# EAGLE design esc (EAGLE 9.4.2)
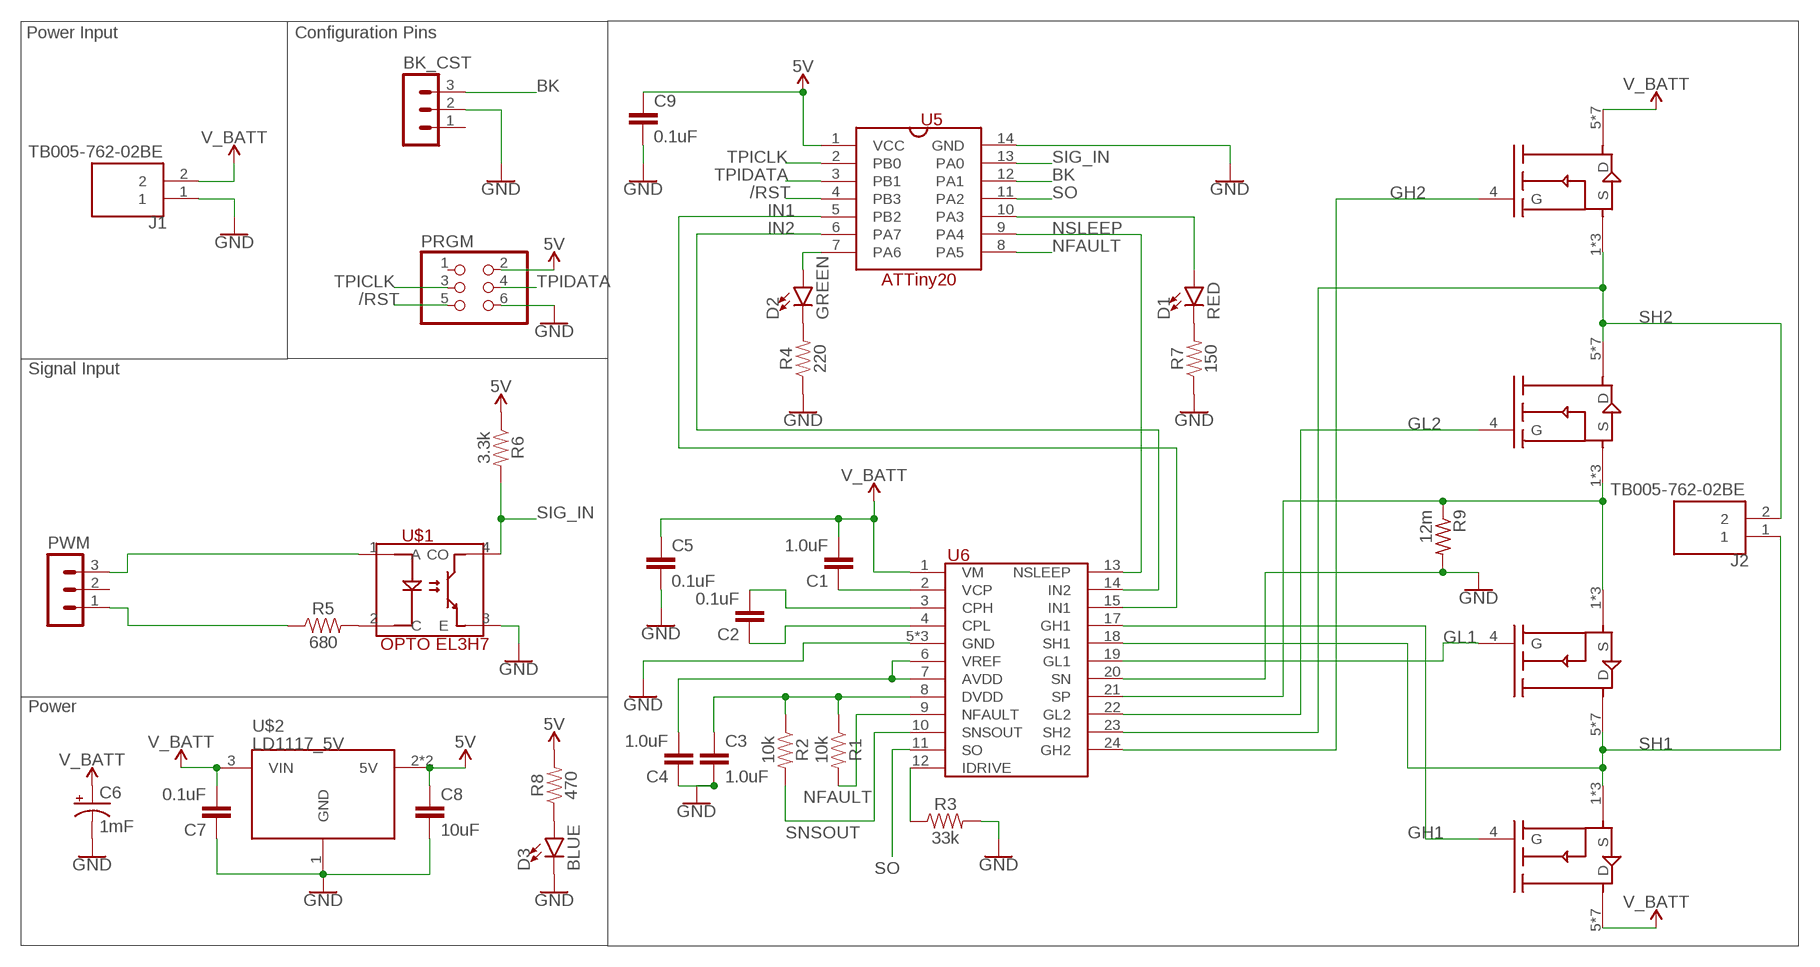
[diagram p0: schematic, sheet 1]

## Parts
BK_CST  MA03-1  [MA03-1]
C1  1.0uF  1.0UF-0603-16V-10%  [0603]
C2  0.1uF  0.1UF-0603-25V-5%  [0603]
C3  1.0uF  1.0UF-0603-16V-10%  [0603]
C4  1.0uF  1.0UF-0603-16V-10%  [0603]
C5  0.1uF  0.1UF-0603-25V-5%  [0603]
C6  1mF  1000UF-RADIAL-5MM-25V-20%  [CPOL-RADIAL-5MM-10MM]
C7  0.1uF  0.1UF-0603-25V-5%  [0603]
C8  10uF  10UF-0603-6.3V-20%  [0603]
C9  0.1uF  0.1UF-0603-25V-5%  [0603]
D1  RED  LED-RED0603  [LED-0603]
D2  GREEN  LED-GREEN0603  [LED-0603]
D3  BLUE  LED-BLUE0603  [LED-0603]
J1  TB005-762-02BE  [CUI_TB005-762-02BE]
J2  TB005-762-02BE  [CUI_TB005-762-02BE]
PRGM  PINHD-2X3  [2X03]
PWM  MA03-1  [MA03-1]
R1  10k  10KOHM-0603-1/10W-1%  [0603]
R2  10k  10KOHM-0603-1/10W-1%  [0603]
R3  33k  33KOHM-0603-1/10W-1%  [0603]
R4  220  220OHM-0603-1/10W-1%  [0603]
R5  680  680OHM-0603-1/10W-5%  [0603]
R6  3.3k  3.3KOHM-0603-1/10W-1%  [0603]
R7  150  150OHM-0603-1/10W-1%  [0603]
R8  470  470OHM-0603-1/10W-1%  [0603]
R9  12m  R-US_R2512  [R2512]
U1  AON6558  [POWER-SO8]
U2  AON6558  [POWER-SO8]
U3  AON6558  [POWER-SO8]
U4  AON6558  [POWER-SO8]
U5  ATTINY20  [SOIC127P599X265-14]
U6  DRV8701  [QFN50P400X400X100-25T280]
U$1  EL3H7  [SOIC127P700X265-4]
U$2  LD1117_5V  [SOT223]

## Nets
5V [5v]: C8.1 C9.1 PRGM.2 R6.1 R8.2 U5.1(VCC) U$2.2(5V) U$2.4(5V)
/RST: PRGM.5 U5.4(PB3)
BK: BK_CST.3 U5.12(PA1)
GH1: U4.4(G) U6.17(GH1)
GH2: U1.4(G) U6.24(GH2)
GL1: U3.4(G) U6.19(GL1)
GL2: U2.4(G) U6.22(GL2)
GND: BK_CST.2 C3.2 C4.1 C5.2 C6.- C7.1 C8.2 C9.2 D3.C J1.1 PRGM.6 R3.2 R4.1 R7.1 R9.2 U5.14(GND) U6.5(GND) U6.16(GND) U6.20(SN) U6.25(GND) U$1.3(E) U$2.1(GND)
IN: PWM.3 U$1.1(A)
IN1: U5.5(PB2) U6.15(IN1)
IN2: U5.6(PA7) U6.14(IN2)
IN_GND: PWM.1 R5.1
N$1: C1.1 U6.2(VCP)
N$2: C2.2 U6.3(CPH)
N$3: C2.1 U6.4(CPL)
N$4: D2.A U5.7(PA6)
N$5: C3.1 R1.1 R2.1 U6.8(DVDD)
N$6: R3.1 U6.12(IDRIVE)
N$7: C4.2 U6.6(VREF) U6.7(AVDD)
N$8: D1.A U5.10(PA3)
N$13: R5.2 U$1.2(C)
N$14: R9.1 U2.1(S) U2.2(S) U2.3(S) U3.1(S) U3.2(S) U3.3(S) U6.21(SP)
N$16: D2.C R4.2
N$17: D1.C R7.2
N$18: D3.A R8.1
NFAULT: R1.2 U5.8(PA5) U6.9(NFAULT)
NSLEEP: U5.9(PA4) U6.13(NSLEEP)
SH1 [power]: J2.1 U3.5(D) U3.6(D) U3.7(D) U3.8(D) U3.PAD(D) U3.SIDEPAD1(D) U3.SIDEPAD2(D) U4.1(S) U4.2(S) U4.3(S) U6.18(SH1)
SH2 [power]: J2.2 U1.1(S) U1.2(S) U1.3(S) U2.5(D) U2.6(D) U2.7(D) U2.8(D) U2.PAD(D) U2.SIDEPAD1(D) U2.SIDEPAD2(D) U6.23(SH2)
SIG_IN: R6.2 U5.13(PA0) U$1.4(CO)
SNSOUT: R2.2 U6.10(SNSOUT)
SO: U5.11(PA2) U6.11(SO)
TPICLK: PRGM.3 U5.2(PB0)
TPIDATA: PRGM.4 U5.3(PB1)
V_BATT [power]: C1.2 C5.1 C6.+ C7.2 J1.2 U1.5(D) U1.6(D) U1.7(D) U1.8(D) U1.PAD(D) U1.SIDEPAD1(D) U1.SIDEPAD2(D) U4.5(D) U4.6(D) U4.7(D) U4.8(D) U4.PAD(D) U4.SIDEPAD1(D) U4.SIDEPAD2(D) U6.1(VM) U$2.3(VIN)
Unconnected: BK_CST.1 PRGM.1 PWM.2

## Notes on the sheet
- Power Input | Configuration Pins
- Signal Input
- Power

## Library data of the parts
BK_CST PWM = con-lstb:MA03-1: PIN HEADER; OC_FARNELL: unknown; OC_NEWARK: unknown
C1 C3 C4 = SparkFun-Capacitors:1.0UF: 1µF ceramic capacitors A capacitor is a passive two-terminal electrical component used to store electrical energy temporarily in an electric field.; PROD_ID: CAP-00868
C2 C5 C7 C9 = SparkFun-Capacitors:0.1UF: 0.1µF ceramic capacitors A capacitor is a passive two-terminal electrical component used to store electrical energy temporarily in an electric field.; PROD_ID: CAP-08604
C6 = SparkFun-Capacitors:1000UF: 1,000µF/1mF ceramic capacitors A capacitor is a passive two-terminal electrical component used to store electrical energy temporarily in an electric field. CAP-08070; PROD_ID: CAP-09538
C8 = SparkFun-Capacitors:10UF: 10.0µF ceramic capacitors A capacitor is a passive two-terminal electrical component used to store electrical energy temporarily in an electric field.; PROD_ID: CAP-11015
D1 = SparkFun-LED:LED-RED: Red SMD LED Used in manufacturing of most products at SparkFun Packages: 0603 - SMD 0603 package [Product Link] <http://docs.avagotech.com/docs/AV02-0551EN> 0603 SMART - SMD 0603 SMART package ( more efficient and expensive)[Product Link] <http://www.osram-os.com/Graphics/XPic2/00077099_0.pdf> 1206 - SMD1206 package [Product Link] <https://www.sparkfun.com/datasheets/DevTools/LilyPad/Q150OVS4.pdff> SparkFun Products: Pro Mini 328 -5V <https://www.sparkfun.com/products/821> RedBoard <https://www.sparkfun.com/products/12757> IOIO-OTG <https://www.sparkfun.com/products/13613>; PROD_ID: DIO-00819
D2 = SparkFun-LED:LED-GREEN: Green SMD LED Used in manufacturing of various products at SparkFun Packages: 0603 - SMD 0603 package [Product Link] <http://www.futureelectronics.com/en/technologies/semiconductors/optoelectronics/leds/Pages/9894312-LTST-C190GKT.aspx?CrossPart=HSMG-C190&IM=0> LilyPad 1206 - SMD1206 LilyPad package [Product Link] <http://www.futureelectronics.com/en/Technologies/Product.aspx?ProductID=IN150NGHARVATEKCORPORATION2049943&IM=0> 1206 - SMD1206 package [Product Link] <http://www.futureelectronics.com/en/technologies/semiconductors/optoelectronics/leds/Pages/8315665-LTST-C150KGKT.aspx?IM=0> 1206 Bottom Mount -SMD 1206 Bottom Mount [Product Link] <http://www.digikey.com/product-detail/en/lite-on-inc/LTST-C230KGKT/160-1456-1-ND/386854> SparkFun Products: Pro Mini 328 -5V <https://www.sparkfun.com/products/821> RedBoard <https://www.sparkfun.com/products/12757> MP3 Trigger <https://www.sparkfun.com/products/13720> Makey Makey <https://www.sparkfun.com/products/11076>; PROD_ID: DIO-00821
D3 = SparkFun-LED:LED-BLUE: Blue SMD LED Used in manufacturing of various products at SparkFun Packages: 0603 - SMD 0603 package [Product Link] <http://www.digikey.com/product-detail/en/SMLE12BC7TT86/511-1589-2-ND/1641808> 1206 - SMD1206 package [Product Link] <http://www.digikey.com/product-detail/en/lite-on-inc/LTST-C150TBKT/160-1643-1-ND/573584> SparkFun Products: ESP8266 Thing-Dev Board <https://www.sparkfun.com/products/13711> RedBoard <https://www.sparkfun.com/products/12757>; PROD_ID: DIO-08575
J1 J2 = TB005-762-02BE:TB005-762-02BE; MANUFACTURER: CUI; STANDARD: Manufacturer Recommendations
PRGM = pinhead:PINHD-2X3: PIN HEADER
R1 R2 = SparkFun-Resistors:10KOHM: 10kΩ resistor A resistor is a passive two-terminal electrical component that implements electrical resistance as a circuit element. Resistors act to reduce current flow, and, at the same time, act to lower voltage levels within circuits. - Wikipedia; PROD_ID: RES-00824
R3 = SparkFun-Resistors:33KOHM: 33kΩ resistor A resistor is a passive two-terminal electrical component that implements electrical resistance as a circuit element. Resistors act to reduce current flow, and, at the same time, act to lower voltage levels within circuits. - Wikipedia; PROD_ID: RES-08416
R4 = SparkFun-Resistors:220OHM: 220Ω resistor A resistor is a passive two-terminal electrical component that implements electrical resistance as a circuit element. Resistors act to reduce current flow, and, at the same time, act to lower voltage levels within circuits. - Wikipedia; PROD_ID: RES-07861
R5 = SparkFun-Resistors:680OHM: 680Ω resistor A resistor is a passive two-terminal electrical component that implements electrical resistance as a circuit element. Resistors act to reduce current flow, and, at the same time, act to lower voltage levels within circuits. - Wikipedia; PROD_ID: RES-09333
R6 = SparkFun-Resistors:3.3KOHM: 3.3kΩ resistor A resistor is a passive two-terminal electrical component that implements electrical resistance as a circuit element. Resistors act to reduce current flow, and, at the same time, act to lower voltage levels within circuits. - Wikipedia; PROD_ID: RES-07851
R7 = SparkFun-Resistors:150OHM: 150Ω resistor A resistor is a passive two-terminal electrical component that implements electrical resistance as a circuit element. Resistors act to reduce current flow, and, at the same time, act to lower voltage levels within circuits. - Wikipedia; PROD_ID: RES-11028
R8 = SparkFun-Resistors:470OHM: 470Ω resistor A resistor is a passive two-terminal electrical component that implements electrical resistance as a circuit element. Resistors act to reduce current flow, and, at the same time, act to lower voltage levels within circuits. - Wikipedia; PROD_ID: RES-07869
R9 = rcl:R-US_: RESISTOR, American symbol; SPICEPREFIX: R
U1-U4 = mine:AON6558
U5 = mine:ATTINY20
U6 = mine:DRV8701
U$1 = mine:EL3H7
U$2 = mine:LD1117_5V

## Net classes
0 default: width 0.305 mm
2 5v: width 0.61 mm

## Board
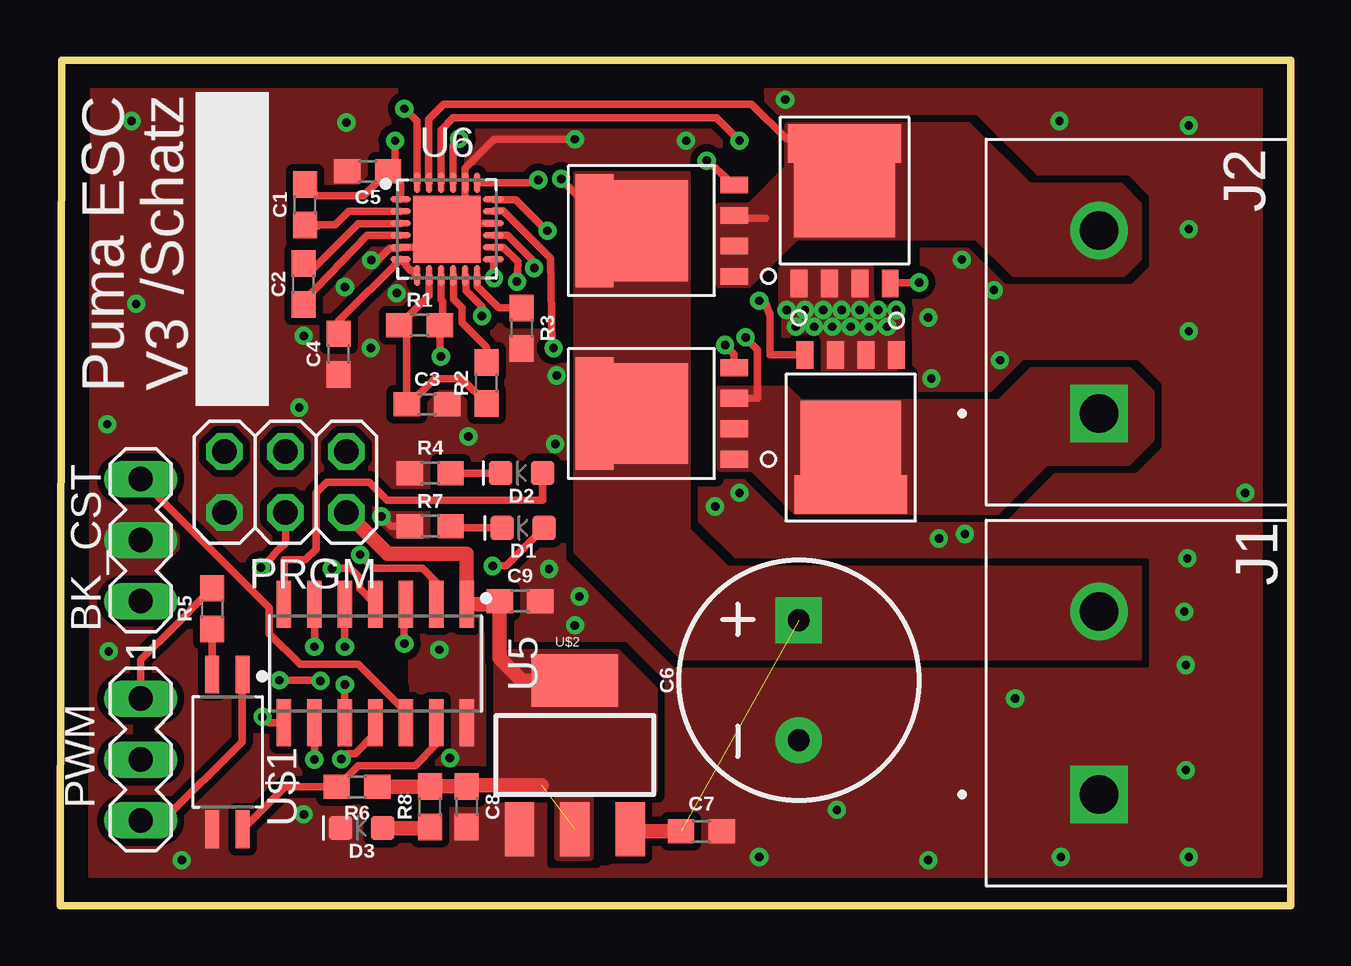
[diagram p1: board, top side]
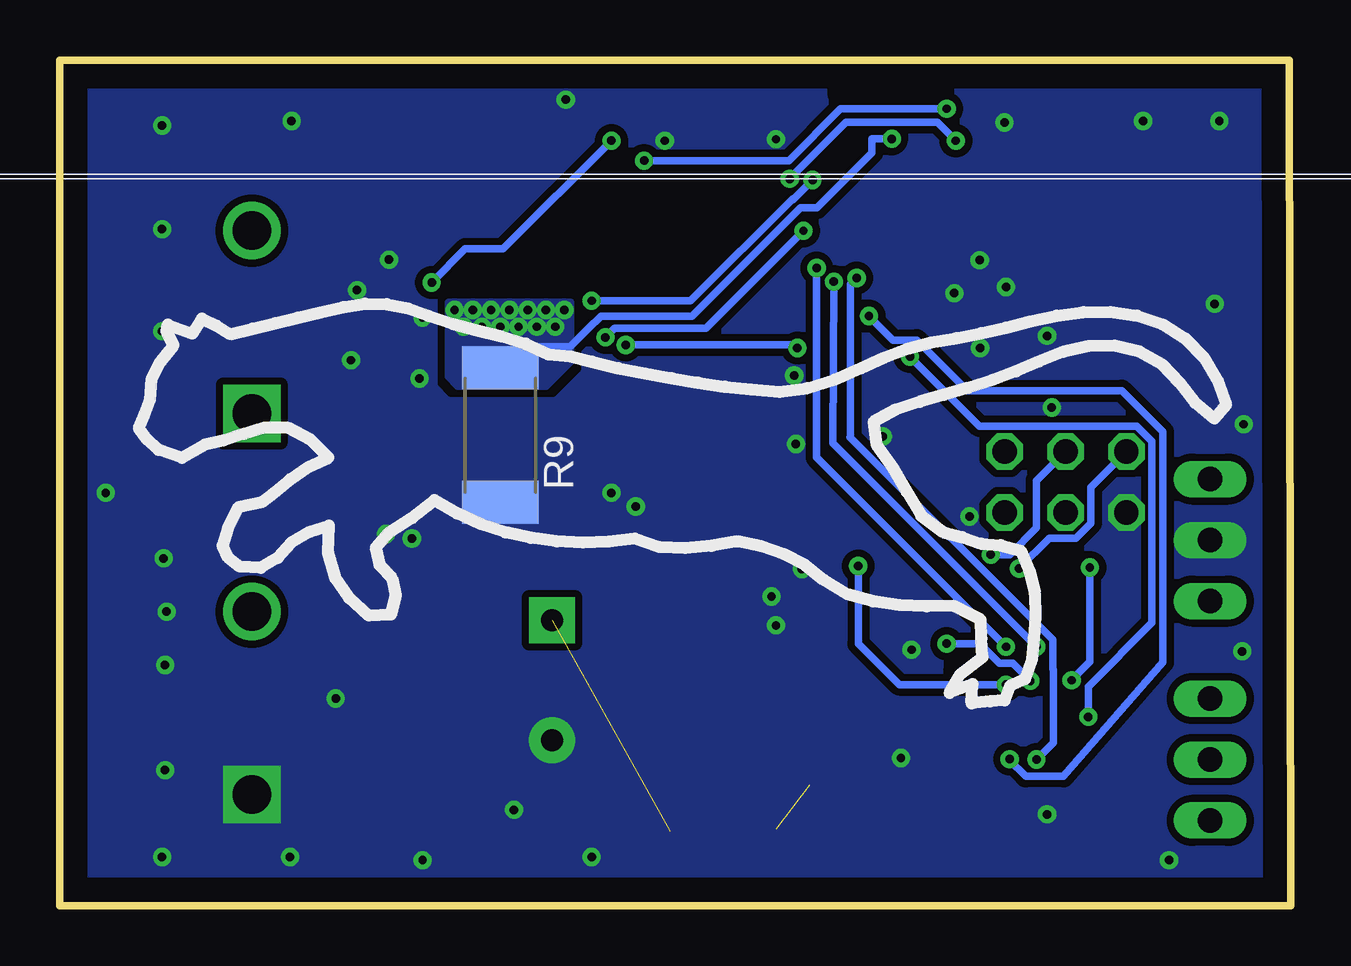
[diagram p2: board, bottom side, seen from below]

Size 51.31 x 35.24 mm. Coordinates in mm from the lower left corner, seen from the top.
Outline: 51.31,0 51.31,35.24 0.06,35.24 0,0 51.31,0
Copper layers (1*16): Top 0.035mm / dielectric 1.5mm / Bottom 0.035mm
Design rules "default *": minimum track width 6mil, minimum drill 0.35mm, track to track 6mil, track to pad 6mil, pad to pad 6mil, via to via 6mil, smd to smd 6mil, copper to edge 40mil, drill to drill 6mil, minimum pad ring 10mil, minimum via ring 8mil, stop-mask expansion 4mil, vias tented up to drill 25mil, thermal gap 10mil
tRestrict: area 26.5,25.3 to 27.3,30.4; area 26.5,17.8 to 27.4,22.7; 9 lines
bRestrict: 2 lines

### Footprints (pad centres in the part's own frame; a part is rotated, then mirrored left to right if it is on the bottom)
MA03-1 = drill 1.016 long: 1 -2.54,0; 2 0,0; 3 2.54,0
0603 = smd 1.1 x 1: 1 -0.85,0; 2 0.85,0
CPOL-RADIAL-5MM-10MM = drill 0.9 pad 1.93 square: + 2.5,0 | drill 0.9 pad 1.93: - -2.5,0
LED-0603 = smd 1 x 1: A -0.877,0; C 0.877,0
CUI_TB005-762-02BE = drill 1.6 square: 1 0,0 | drill 1.6: 2 7.62,0
2X03 = drill 1.016 octagon: 1 -2.54,-1.27; 2 -2.54,1.27; 3 0,-1.27; 4 0,1.27; 5 2.54,-1.27; 6 2.54,1.27
R2512 = smd 1.8 x 3.2: 1 -2.8,0; 2 2.8,0
POWER-SO8 = smd 1.15 x 0.7: 1 -3.02,1.905; 2 -3.02,0.635; 3 -3.02,-0.635; 4 -3.02,-1.905 | smd 0.9 x 0.6: 5 3,-1.905; 6 3,-0.635; 7 3,0.635; 8 3,1.905 | smd 4.7 x 4.2: PAD 1.25,0 | smd 1.6 x 0.25: SIDEPAD1 2.8,-2.225; SIDEPAD2 2.8,2.225
SOIC127P599X265-14 = smd 1.965 x 0.602: 1 -2.47,3.81; 2 -2.47,2.54; 3 -2.47,1.27; 4 -2.47,0; 5 -2.47,-1.27; 6 -2.47,-2.54; 7 -2.47,-3.81; 8 2.47,-3.81; 9 2.47,-2.54; 10 2.47,-1.27; 11 2.47,0; 12 2.47,1.27; 13 2.47,2.54; 14 2.47,3.81
QFN50P400X400X100-25T280 = smd 0.86 x 0.264: 1 -1.935,1.25; 2 -1.935,0.75; 3 -1.935,0.25; 4 -1.935,-0.25; 5 -1.935,-0.75; 6 -1.935,-1.25; 13 1.935,-1.25; 14 1.935,-0.75; 15 1.935,-0.25; 16 1.935,0.25; 17 1.935,0.75; 18 1.935,1.25 | smd 0.264 x 0.86: 7 -1.25,-1.935; 8 -0.75,-1.935; 9 -0.25,-1.935; 10 0.25,-1.935; 11 0.75,-1.935; 12 1.25,-1.935; 19 1.25,1.935; 20 0.75,1.935; 21 0.25,1.935; 22 -0.25,1.935; 23 -0.75,1.935; 24 -1.25,1.935 | smd 2.8 x 2.8: 25 0,0
SOIC127P700X265-4 = smd 1.564 x 0.589: 1 -3.223,0.635; 2 -3.223,-0.635; 3 3.223,-0.635; 4 3.223,0.635
SOT223 = smd 1.219 x 2.235: 1 -2.311,-3.099; 2 0,-3.099; 3 2.311,-3.099 | smd 3.6 x 2.2: 4 0,3.099

### Placement (x,y rotation side)
BK_CST  3.37,15.24 90 top
C1  10.22,29.21 90 top
C2  10.16,25.91 90 top
C3  15.3,20.89 0 top
C4  11.62,22.99 90 top
C5  12.83,30.61 180 top
C6  30.8,9.4 90 top
C7  26.73,3.11 180 top
C8  16.95,4.13 270 top
C9  19.18,12.7 0 top
D1  19.3,15.75 180 top
D2  19.24,18.03 180 top
D3  12.57,3.24 180 top
J1  43.31,4.64 90 top
J2  43.31,20.51 90 top
PRGM  9.4,17.65 180 top
PWM  3.37,6.1 270 top
R1  14.99,24.19 0 top
R2  17.78,21.78 90 top
R3  19.24,24.07 270 top
R4  15.43,18.03 0 top
R5  6.35,12.38 270 top
R6  12.38,4.95 180 top
R7  15.43,15.81 0 top
R8  15.43,4.13 90 top
R9  32.96,19.62 270 bottom
U1  25.08,28.13 180 top
U2  32.7,28.96 90 top
U3  32.96,19.94 270 top
U4  25.08,20.51 180 top
U5  13.14,10.1 270 top
U6  16.13,28.19 0 top
U$1  6.99,6.41 270 top
U$2  21.46,6.29 0 top

### Tracks (layer width: path | path; a pad name or v marks a point on that pad's centre or on a via)
5V  (1 unrouted)
  Top 0.61: 20.07,5.02 16.99,5.02 C8.1 R8.2 15.41,4.95 R6.1 | 20.14,9.39 U$2.4 19.25,9.39 18.33,10.31 C9.1 18.19,12.57 U5.1 16.95,14.67 13.65,14.67 PRGM.2
  pour Top (no thermals): 24.7,4.76 18.22,4.76 18.22,10.03 18.73,10.54 23.24,10.54 24.77,9.02 24.77,4.83
  pour Top (no thermals): 20.76,2.03 22.1,2.03 22.1,4.64 20.76,4.64
/RST  (via drill 0.35)
  Top 0.305: U5.4 12.48,13.23 12.48,13.68 12.1,14.06 v11.33,14.06
  Bottom 0.305: PRGM.5 8.33,17.45 8.33,15.94 8.96,15.32 10.07,15.32 v11.33,14.06
BK
  Top 0.305: BK_CST.3 8.73,12.42 8.73,11.33 10,10.06 12.43,10.06 14.48,8 14.41,8 U5.12
GH1  (via drill 0.35)
  Top 0.305: U6.17 | v27.72,23.37 28.1,22.99 U4.4 | v20.57,23.24 20.51,23.31 20.45,26.98 18.48,28.96 18.08,28.96 U6.17
  Bottom 0.305: v27.72,23.37 20.7,23.37 v20.57,23.24
GH2  (via drill 0.35)
  Top 0.305: U6.24 14.88,32.68 v14.35,33.21 | v26.96,31.05 U1.4
  Bottom 0.305: v14.35,33.21 18.77,33.21 20.93,31.05 v26.96,31.05
GL1  (via drill 0.35)
  Top 0.305: U6.19 19.83,30.13 v19.94,30.24 | v29.15,25.21 29.4,25.11 29.59,24.62 29.59,22.96 U3.4
  Bottom 0.305: v29.15,25.21 25.02,25.21 20.76,29.46 20.76,29.42 v19.94,30.24
GL2  (via drill 0.35)
  Top 0.305: U6.22 15.88,32.32 16.39,32.83 27.37,32.83 v28.32,31.88 | v35.81,25.97 34.64,25.97 U2.4
  Bottom 0.305: v35.81,25.97 34.42,27.37 32.83,27.37 v28.32,31.88
GND  (via drill 0.35)
  Top 0.305: U6.16 16.57,28.44 | 16.57,28.44 16.38,28.44 U6.25 15.38,27.44 U6.5 14.15,27.4 13.74,27.4 13.24,26.91 v12.97,26.91 | R7.1 13.81,15.81 v13.4,16.22 | 16.57,28.44 16.88,28.75 U6.20 16.88,30.72 18.1,31.94 v21.46,31.94
  other vias: 15.81,10.67 20.7,22.1 20.64,19.24 17.02,19.56 9.97,20.76 5.08,1.91 2.03,10.6 20.38,14.03 21.46,11.68 47.05,2.03 47.05,32.51 41.66,32.7 47.05,28.19 47.05,23.94 49.4,17.21 46.99,14.48 46.93,10.03 46.93,5.65 41.72,2.03 36.2,1.91 29.15,2.03 32.38,4 39.81,8.64 46.86,12.26 37.72,15.49 36.64,15.3 11.94,32.64 6.16,32.7 2.98,32.7 3.18,25.08 1.97,20.07 11.87,25.78 26.1,31.88 37.59,26.92 36.32,21.97 36.2,24.51 38.93,25.65 39.18,22.73 30.23,33.59 28.32,17.21 27.3,16.64 21.65,12.89 10.16,3.81 14.03,25.53 10.16,23.75 12.95,23.24 16.26,6.16
  pour Top (isolate 0.305, rank 2, no thermals): -0.13,35.31 -0.13,0.06 51.31,0.06 51.31,35.31
  pour Bottom (isolate 0.305, rank 2, no thermals): -0.06,35.31 -0.06,0 51.24,0 51.24,35.31
IN
  Top 0.305: U$1.1 7.58,9.6 7.58,6.84 4.3,3.56 PWM.3
IN1  (via drill 0.35)
  Top 0.305: U6.15 18.65,27.94 19.77,26.83 v19.77,26.57 | v11.87,10.79 U5.5
  Bottom 0.305: v19.77,26.57 19.77,18.69 v11.87,10.79
IN2  (via drill 0.35)
  Top 0.305: U6.14 | U6.14 18.48,27.44 19.08,26.84 v19.05,26.01 | v10.6,10.79 U5.6
  Bottom 0.305: v19.05,26.01 19.08,19.27 v10.6,10.79
IN_GND
  Top 0.305: PWM.1 3.37,10.25 4.75,11.63 4.76,11.63 5.38,12.26 5.38,12.27 R5.1
N$1
  Top 0.305: U6.2 12.04,28.94 11.46,28.37 10.79,28.37 10.74,28.32 C1.1
N$2
  Top 0.305: U6.3 14.19,28.42 12.43,28.42 10.43,26.42 10.43,26.49 C2.2
N$3
  Top 0.305: C2.1 10.16,25.19 12.81,27.94 U6.4
N$4
  Top 0.305: D2.A 20.12,16.9 13.64,16.9 12.89,17.65 11.11,17.65 10.67,17.21 10.67,14.86 10.22,14.41 9.33,14.41 U5.7
N$5
  Top 0.305: U6.8 15.38,25.44 R1.1 14.45,23.88 C3.1 14.55,20.89 15.62,21.97 16.74,21.97 R2.1
N$6
  Top 0.305: R3.1 18.28,24.92 17.38,25.81 U6.12
N$7
  Top 0.305: U6.7 14.65,26.49 14.6,26.49 14.42,26.67 14.42,26.71 U6.6 11.62,24.37 C4.2
N$8  (via drill 0.35)
  Top 0.305: D1.A 18.59,14.16 v18.03,14.16 | v11.87,9.22 U5.10
  Bottom 0.305: v18.03,14.16 18.03,10.92 16.33,9.22 v11.87,9.22
N$13
  Top 0.305: R5.2 U$1.2
N$14  (via drill 0.35)
  Top 0.305: v16.64,31.96 16.38,31.7 U6.21
  Bottom 0.305: R9.1 32.07,23.3 30.05,23.3 29.3,24.05 29.29,24.05 28.77,24.57 24.97,24.57 20.45,29.08 19.75,29.08 17.46,31.37 17.46,31.96 v16.64,31.96
  other vias: 31.05,24.83 31.81,24.83 32.58,24.83 33.34,24.83 31.43,24.13 32.19,24.13 32.96,24.13 33.72,24.13 34.48,24.13 30.67,24.13 34.1,24.83 34.86,24.83 30.29,24.83
  pour Top (isolate 0.305, no thermals): 30.1,26.54 33.78,26.54 33.78,25.4 34.1,25.08 35.05,25.08 35.05,22.42 31.75,22.42 31.75,23.69 31.62,23.81 30.1,23.81
  pour Bottom (isolate 0.305, no thermals): 30.04,25.15 35.12,25.15 35.12,22.03 34.73,21.65 31.05,21.65 30.04,22.67
N$16
  Top 0.305: D2.C R4.2
N$17
  Top 0.305: D1.C 16.34,15.75 R7.2
N$18
  Top 0.61: R8.1 15.47,3.24 D3.A
NFAULT  (via drill 0.35)
  Top 0.305: U6.9 15.88,25.24 15.94,25.18 15.94,24.3 R1.2 15.84,22.93 v15.88,22.89 | v8.45,7.87 8.69,7.63 U5.8
  Bottom 0.305: v8.45,7.87 8.45,9.13 5.79,11.79 5.79,19.37 6.42,19.99 12.98,19.99 v15.88,22.89
NSLEEP  (via drill 0.35)
  Top 0.305: v18.1,26.16 18.06,26.16 U6.13 | v10.6,6.1 U5.9
  Bottom 0.305: v18.1,26.16 18.35,25.91 18.35,19.56 18.38,19.53 9.92,11.08 9.92,9.86 9.91,9.84 9.91,6.79 v10.6,6.1
SH1  (via drill 0.35)
  Top 0.305: U4.3 29.08,21.15 29.08,23.18 v28.57,23.68 | v20.32,28.13 20.29,28.1 18.99,29.41 18.09,29.41 U6.18
  Bottom 0.305: v20.32,28.13 24.39,24.06 28.2,24.06 v28.57,23.68
  pour Top (no thermals): 27.5,21.53 28.7,21.53 30.29,21.53 30.86,20.95 39.18,20.95 40.51,22.29 44.58,22.29 45.47,21.4 45.47,19.43 44.64,18.61 44.51,18.48 41.08,18.48 39.05,16.45 30.67,16.45 28.89,18.22 27.56,18.22 27.5,18.29
SH2
  Top 0.305: U6.23 15.36,30.15 15.36,32.77 15.99,33.4 28.83,33.4 30.27,31.96 U2.8 | 29.4,28.64 28.23,28.64 U1.3
  pour Top (no thermals): 27.5,29.15 28.77,29.15 28.83,29.21 30.35,30.73 30.35,32.51 37.85,32.51 40.39,29.97 44.2,29.97 44.96,29.21 44.96,26.99 44.32,26.35 39.75,26.35 38.23,27.88 30.67,27.88 28.7,25.91 27.5,25.91
SIG_IN
  Top 0.305: U5.13 15.68,6.73 14.8,5.84 12.42,5.84 R6.2 9.38,4.95 U$1.4
SNSOUT
  Top 0.305: R2.2 17.78,23.27 16.75,24.29 16.75,24.92 16.4,25.27 16.4,26.26 U6.10
SO  (via drill 0.35)
  Top 0.305: U6.11 16.92,26.22 16.92,25.63 17.59,24.96 v17.59,24.57 | v11.73,6.11 11.95,6.34 12.3,6.34 13.14,7.18 U5.11
  Bottom 0.305: v17.59,24.57 16.59,23.57 15.59,23.57 13.48,21.46 7.05,21.46 5.33,19.75 5.33,10.14 9.48,5.4 11.05,5.4 11.73,6.07 v11.73,6.11
TPICLK  (via drill 0.35)
  Top 0.305: v12.51,14.63 13.08,14.06 15.11,14.06 15.68,13.49 U5.2
  Bottom 0.305: PRGM.3 10.6,17.72 10.6,15.75 11.72,14.63 v12.51,14.63
TPIDATA  (via drill 0.35)
  Top 0.305: PRGM.4 9.4,15.11 9.16,14.87 9.15,14.87 8.88,14.6 8.88,14.59 v8.38,14.1 | v9.14,9.4 10.83,9.4 v10.86,9.37 | v14.35,10.92 14.35,12.5 U5.3
  Bottom 0.305: v8.38,14.1 8.38,10.16 v9.14,9.4 | v10.86,9.37 11.6,10.11 12.16,10.11 12.97,10.92 v14.35,10.92
V_BATT  (via drill 0.35)  (1 unrouted)
  Top 0.305: U6.1 14.19,30.09 C5.1 | C5.1 12.66,29.59 10.69,29.59 C1.2 | v13.97,31.88 13.97,30.9 C5.1 | U1.6 22.08,29.08 20.89,30.27 v20.89,30.29
  Top 0.61: U$2.3 23.85,3.11 C7.2
  Bottom 0.305: v13.97,31.88 14.73,32.64 18.54,32.64 v20.89,30.29
  pour Top (no thermals): 21.46,30.54 21.46,14.73 25.91,10.29 45.02,10.29 45.02,14.1 27.81,14.1 26.23,15.68 26.23,30.54

### Text on the board
tNames: /Schatz | Puma ESC | V3